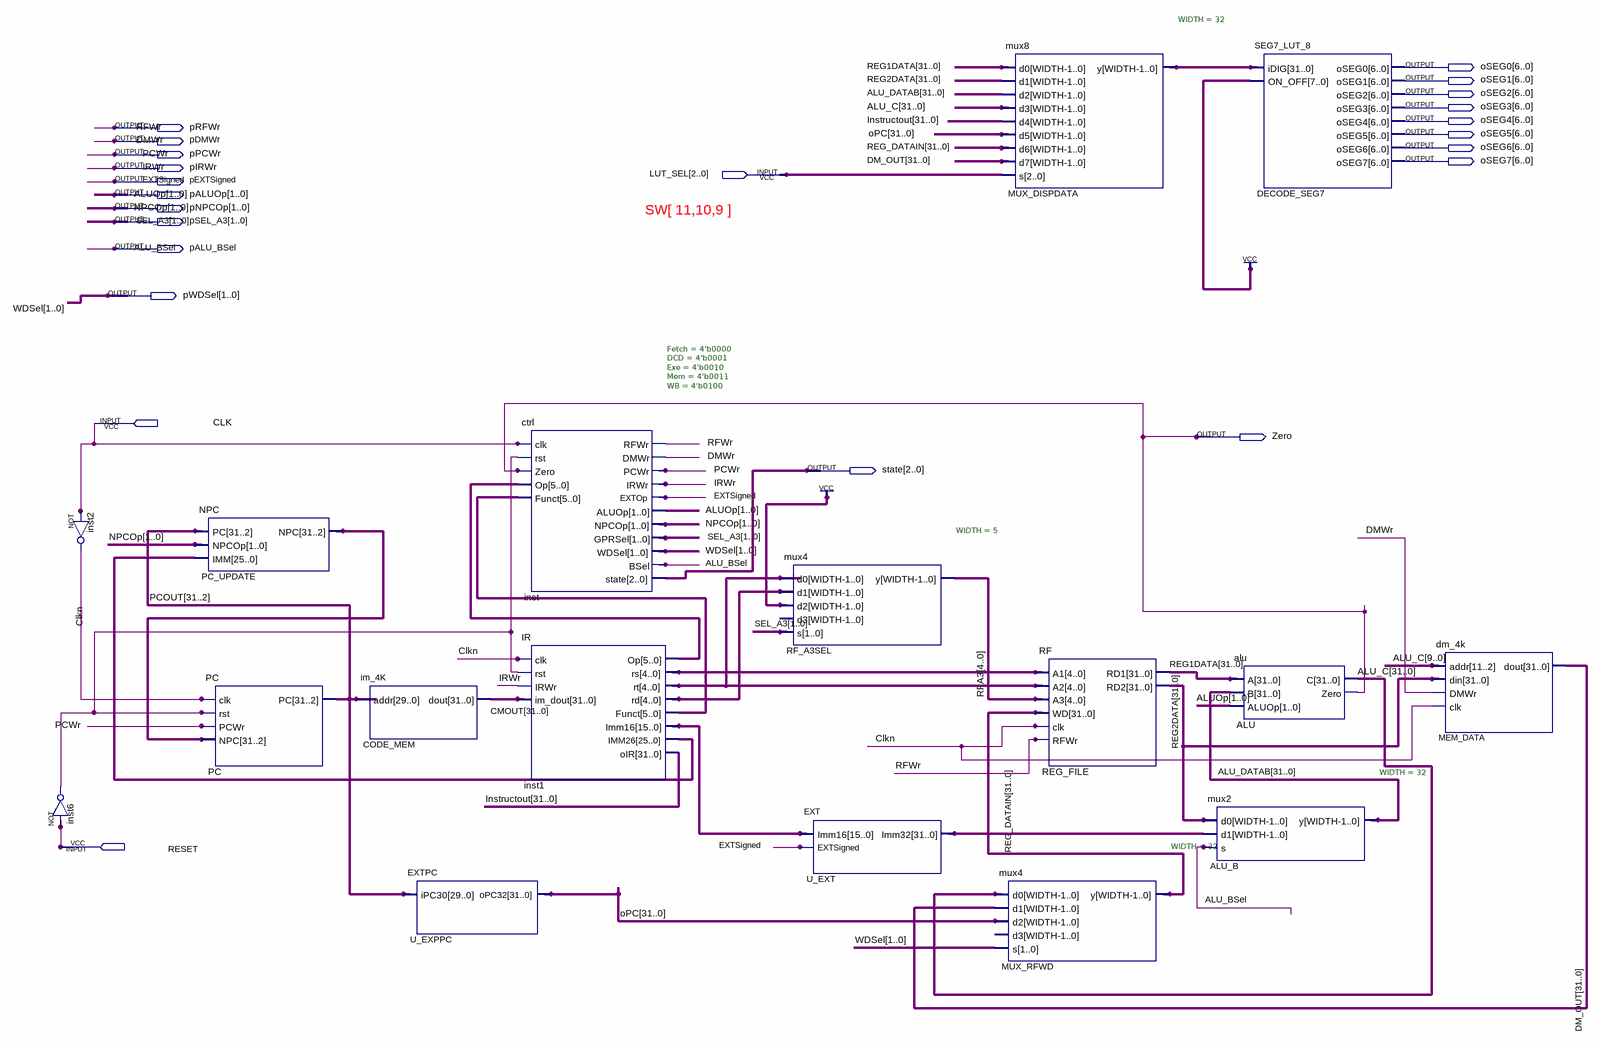
[diagram p0: schematic sheet]
// Quartus schematic MIPS_CPU.bdf as structural Verilog: 17 symbols, 23 pins
module MIPS_CPU (
  input  [2:0] LUT_SEL,
  input  CLK,
  input  RESET,
  output [6:0] oSEG0,
  output [6:0] oSEG1,
  output [6:0] oSEG2,
  output [6:0] oSEG3,
  output [6:0] oSEG4,
  output pRFWr,
  output [6:0] oSEG5,
  output pDMWr,
  output [6:0] oSEG6,
  output pPCWr,
  output [6:0] oSEG7,
  output pIRWr,
  output pEXTSigned,
  output [1:0] pALUOp,
  output [1:0] pNPCOp,
  output [1:0] pSEL_A3,
  output pALU_BSel,
  output [1:0] pWDSel,
  output Zero,
  output [2:0] state
);

  wire Clkn, inst6_out;
  wire [4:0] inst1_rd, inst1_rs, inst1_rt, RFA3;
  wire [5:0] inst1_funct, inst1_op;
  wire [15:0] inst1_imm16;
  wire [25:0] inst1_imm26;
  wire [29:0] PC_UPDATE_npc;
  wire [31:0] ALU_C, ALU_DATAB, CMOUT, DM_OUT, Instructout, MUX_DISPDATA_y, oPC, REG1DATA, REG2DATA,
       REG_DATAIN, U_EXT_imm32;
  wire [31:2] PCOUT;

  not inst6 (inst6_out, RESET);
  not inst2 (Clkn, CLK);
  NPC PC_UPDATE (.PC(PCOUT), .NPCOp(pNPCOp), .IMM(inst1_imm26), .NPC(PC_UPDATE_npc));
  PC PC (.clk(Clkn), .rst(inst6_out), .PCWr(pPCWr), .NPC(PC_UPDATE_npc), .PC(PCOUT));
  im_4K CODE_MEM (.addr(PCOUT), .dout(CMOUT));
  EXTPC U_EXPPC (.iPC30(PCOUT), .oPC32(oPC));
  ctrl #(.Fetch(4'b0000), .DCD(4'b0001), .Exe(4'b0010), .Mem(4'b0011), .WB(4'b0100)) inst (
    .clk(CLK), .rst(inst6_out), .Zero(Zero), .Op(inst1_op), .Funct(inst1_funct), .RFWr(pRFWr), .DMWr(pDMWr),
    .PCWr(pPCWr), .IRWr(pIRWr), .EXTOp(pEXTSigned), .ALUOp(pALUOp), .NPCOp(pNPCOp), .GPRSel(pSEL_A3),
    .WDSel(pWDSel), .BSel(pALU_BSel), .state(state));
  IR inst1 (
    .clk(Clkn), .rst(inst6_out), .IRWr(pIRWr), .im_dout(CMOUT), .Op(inst1_op), .rs(inst1_rs), .rt(inst1_rt),
    .rd(inst1_rd), .Funct(inst1_funct), .Imm16(inst1_imm16), .IMM26(inst1_imm26), .oIR(Instructout));
  mux4 #(.WIDTH(5)) RF_A3SEL (.d0(inst1_rt), .d1(inst1_rd), .d2({5{1'b1}}), .s(pSEL_A3), .y(RFA3));  // open: d3
  EXT U_EXT (.Imm16(inst1_imm16), .EXTSigned(pEXTSigned), .Imm32(U_EXT_imm32));
  mux8 #(.WIDTH(32)) MUX_DISPDATA (
    .d0(REG1DATA), .d1(REG2DATA), .d2(ALU_DATAB), .d3(ALU_C), .d4(Instructout), .d5(oPC), .d6(REG_DATAIN),
    .d7(DM_OUT), .s(LUT_SEL), .y(MUX_DISPDATA_y));
  mux4 #(.WIDTH(32)) MUX_RFWD (.d0(ALU_C), .d1(DM_OUT), .d2(oPC), .s(pWDSel), .y(REG_DATAIN));  // open: d3
  RF REG_FILE (
    .A1(inst1_rs), .A2(inst1_rt), .A3(RFA3), .WD(REG_DATAIN), .clk(Clkn), .RFWr(pRFWr), .RD1(REG1DATA),
    .RD2(REG2DATA));
  alu ALU (.A(REG1DATA), .B(ALU_DATAB), .ALUOp(pALUOp), .C(ALU_C), .Zero(Zero));
  mux2 #(.WIDTH(32)) ALU_B (.d0(REG2DATA), .d1(U_EXT_imm32), .s(pALU_BSel), .y(ALU_DATAB));
  SEG7_LUT_8 DECODE_SEG7 (
    .iDIG(MUX_DISPDATA_y), .ON_OFF({8{1'b1}}), .oSEG0(oSEG0), .oSEG1(oSEG1), .oSEG2(oSEG2), .oSEG3(oSEG3),
    .oSEG4(oSEG4), .oSEG5(oSEG5), .oSEG6(oSEG6), .oSEG7(oSEG7));
  dm_4k MEM_DATA (.addr(ALU_C[9:0]), .din(REG2DATA), .DMWr(pDMWr), .clk(Clkn), .dout(DM_OUT));

  // Other names for the same wires on the sheet: ALU_BSel = pALU_BSel; ALUOp[1:0] = pALUOp; DMWr = pDMWr;
  //   EXTSigned = pEXTSigned; IRWr = pIRWr; NPCOp[1:0] = pNPCOp; PCWr = pPCWr; RFWr = pRFWr; SEL_A3[1:0] = pSEL_A3;
  //   WDSel[1:0] = pWDSel

  // Notes on the sheet:
  //   SW[ 11,10,9 ]
endmodule
